# Altium schematic sheet uC_Environment.SchDoc
size A3; SheetNumber: 1; SheetTotal: 3; ENG_APP_DATE: --/--/--; DSN_APP_DATE: --/--/--; CHK_APP_DATE: --/--/--
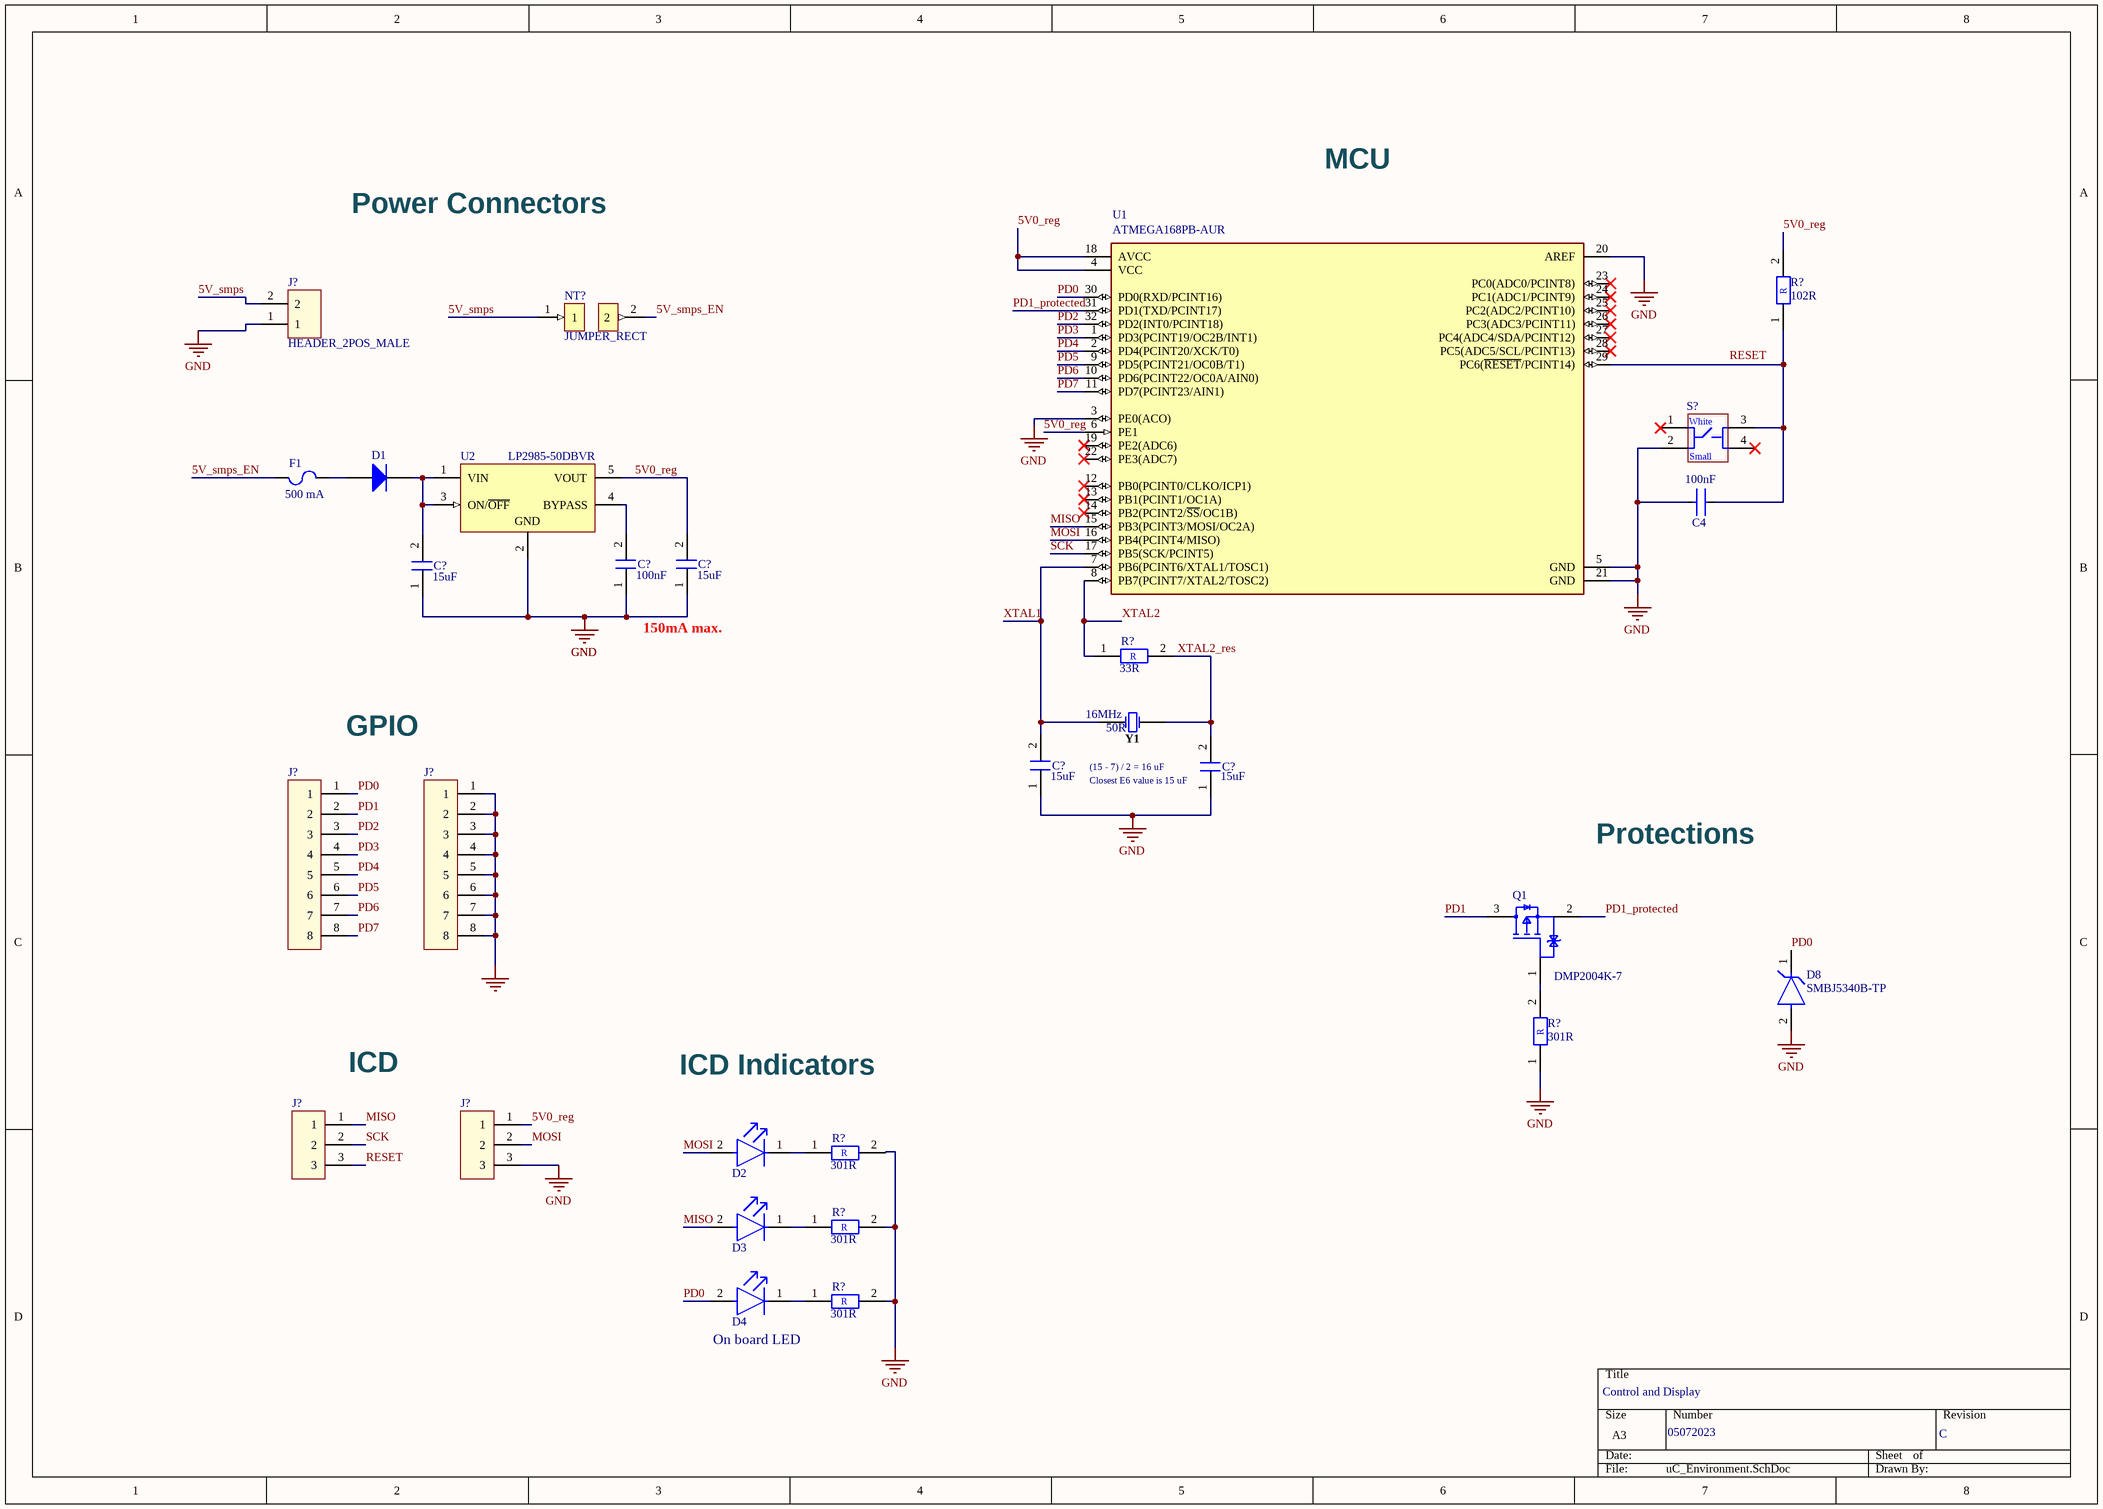
[diagram p0: uC_Environment.SchDoc]

## Parts
(Parts that share a designator on the sheet are numbered #1, #2 ... from top to bottom, then left to right.)
C4  Capacitance: 100nF  [FP-CL21-IPC_A]  (hidden comment: CL21B104KBCNNNC)
C?#1  Capacitance: 15uF  [0805_R]  (hidden comment: P.N.)
C?#2  Capacitance: 100nF  [0805_R]  (hidden comment: P.N.)
C?#3  Capacitance: 15uF  [0805_R]  (hidden comment: P.N.)
C?#4  Capacitance: 15uF  [0805_R]  (hidden comment: P.N.)
C?#5  Capacitance: 15uF  [0805_R]  (hidden comment: P.N.)
D1  SMAJ30A-E3/61  [VISH-DO-214AC-2_N]  (value not drawn)
D2  LTST-C191TBKT  [FP-LTST-C191TBKT-MFG]  (value not drawn)
D3  LTST-C191TBKT  [FP-LTST-C191TBKT-MFG]  (value not drawn)
D4  LTST-C191TBKT  [FP-LTST-C191TBKT-MFG]  (value not drawn)
D8  SMBJ5340B-TP  [FP-DO-214AA-MFG]
F1  Parameter 1: 500 mA  [0ZCJ0050AF2E-Footprint-1]  (hidden comment: 0ZCJ0050AF2E)
J?#1  HEADER_2POS_MALE  [HEADER_2POS_MALE_VERT_2.54MM]
J?#2  HEADER_8POS_MALE  [HEADER_8POS_MALE_VERT_2.54MM]  (value not drawn)
J?#3  HEADER_8POS_MALE  [HEADER_8POS_MALE_VERT_2.54MM]  (value not drawn)
J?#4  HEADER_3POS_MALE  [HEADER_3POS_MALE_VERT_2.54MM]  (value not drawn)
J?#5  HEADER_3POS_MALE  [HEADER_3POS_MALE_VERT_2.54MM]  (value not drawn)
NT?  JUMPER_RECT
Q1  DMP2004K-7  [FP-SOT23-MFG]
R?#1  Resistance: 102R  [0805_R]  (hidden comment: P.N.)
R?#2  Resistance: 33R  [0805_R]  (hidden comment: P.N.)
R?#3  Resistance: 301R  [0805_R]  (hidden comment: P.N.)
R?#4  Resistance: 301R  [0805_R]  (hidden comment: P.N.)
R?#5  Resistance: 301R  [0805_R]  (hidden comment: P.N.)
R?#6  Resistance: 301R  [0805_R]  (hidden comment: P.N.)
S?  TACT_SWITCH_SMD_5x3MM  [TACT_SWITCH_SMD_5x3MM]  (value not drawn)
U1  ATMEGA168PB-AUR  [FP-32A-MFG]
U2  LP2985-50DBVR  [DBV0005A_M]
Y1  Frequency: 16MHz  ESR (Equivalent Series Resistance): 50R  [ECS-160-20-3X-EN-TR-Footprint-1]  (hidden comment: ECS-160-20-3X-EN-TR)

## Nets
GND: C4.1 C?#1.1 C?#2.1 C?#3.1 C?#4.1 C?#5.1 D8.2(A) J?#1.1 J?#3.1 J?#3.2 J?#3.3 J?#3.4 J?#3.5 J?#3.6 J?#3.7 J?#3.8 J?#5.3 R?#3.1 R?#4.2 R?#5.2 R?#6.2 S?.2 U1.3(PE0(ACO)) U1.5(GND) U1.20(AREF) U1.21(GND) U2.2(GND)
5V0_reg: C?#3.2 J?#5.1 R?#1.2 U1.4(VCC) U1.6(PE1) U1.18(AVCC) U2.5(VOUT)
5V_smps: J?#1.2 NT?.1
5V_smps_EN: F1.1(IN) NT?.2
MISO: D3.2(A) J?#4.1 U1.15(PB3(PCINT3/MOSI/OC2A))
MOSI: D2.2(A) J?#5.2 U1.16(PB4(PCINT4/MISO))
PD0: D4.2(A) D8.1(C) J?#2.1 U1.30(PD0(RXD/PCINT16))
PD1: J?#2.2 Q1.3(D)
PD1_protected: Q1.2(S) U1.31(PD1(TXD/PCINT17))
PD2: J?#2.3 U1.32(PD2(INT0/PCINT18))
PD3: J?#2.4 U1.1(PD3(PCINT19/OC2B/INT1))
PD4: J?#2.5 U1.2(PD4(PCINT20/XCK/T0))
PD5: J?#2.6 U1.9(PD5(PCINT21/OC0B/T1))
PD6: J?#2.7 U1.10(PD6(PCINT22/OC0A/AIN0))
PD7: J?#2.8 U1.11(PD7(PCINT23/AIN1))
RESET: J?#4.3
SCK: J?#4.2 U1.17(PB5(SCK/PCINT5))
XTAL1: C?#4.2 U1.7(PB6(PCINT6/XTAL1/TOSC1)) Y1.2
XTAL2: R?#2.1 U1.8(PB7(PCINT7/XTAL2/TOSC2))
XTAL2_res: C?#5.2 R?#2.2 Y1.1
NetC4_2: C4.2 R?#1.1 S?.3 U1.29(PC6(~{RESET}/PCINT14))
NetC?#1_2: C?#1.2 D1.1(K) U2.1(VIN) U2.3(ON/~{OFF})
NetC?#2_2: C?#2.2 U2.4(BYPASS)
NetD1_2: D1.2(A) F1.2(OUT)
NetD2_1: D2.1(C) R?#4.1
NetD3_1: D3.1(C) R?#5.1
NetD4_1: D4.1(C) R?#6.1
NetQ1_1: Q1.1(G) R?#3.2

Not connected (* = marked no-connect by the designer): S? 1* 4*; U1 12(PB0(PCINT0/CLKO/ICP1))* 13(PB1(PCINT1/OC1A))* 14(PB2(PCINT2/~{SS}/OC1B))* 19(PE2(ADC6))* 22(PE3(ADC7))* 23(PC0(ADC0/PCINT8))* 24(PC1(ADC1/PCINT9))* 25(PC2(ADC2/PCINT10))* 26(PC3(ADC3/PCINT11))* 27(PC4(ADC4/SDA/PCINT12))* 28(PC5(ADC5/SCL/PCINT13))*

## Notes on the sheet
- MCU
- Power Connectors
- (near C?#3) 150mA max.
- GPIO
- (15 - 7) / 2 = 16 uF
- (near C?#5) Closest E6 value is 15 uF
- Protections
- (near J?#4) ICD
- ICD Indicators
- On board LED
- Control and Display
- 05072023
- C
- Labels drawn without touching a wire or pin: RESET
- DWG. NO.
- REV.
- SHT.
- THIS DOCUMENT AND THE DATA DISCLOSED HEREIN OR HEREWITH IS THE PROPERTY OF ALTIUM LIMITED AND MAY BE FREELY DISTRIBUTED IN WHOLE. NO RIGHTS ARE RESERVED OR EXPRESS OR IMPLIED WARANTEE GIVEN.
- REVISION
- DESCRIPTION
- DATE
- APPROVED
- ENG:
- APPROVALS
- PROJECT
- DSN:
- CHK:
- REFERENCE DOCUMENTS
- PROJECT REVISION:
- TITLE
- DOCUMENT REVISION:
- DESIGN ITEM:
- BOM:
- FAB DWG:
- PCB DWG:
- ASSY DWG:
- SCALE:
- SIZE
- B
- CAGE CODE
- FILE NAME
- DWG NO.
- SHEET
- OF
- REV
- (in symbol 0805_R) R
- (in symbol TACT_SWITCH_SMD_5x3MM) White; Small

## Library data of the parts
C4 = CMP-2000-05017-2: CL21 Series 0805 100nF 50V ±10% Tolerance X7R Multilayer Ceramic Chip Capacitor; Depth: 1.25mm; Height: 0.85mm; Width: 0.049inch; Tolerance: 10%; Case Code (Metric): 2012; Case Code (Imperial): 0805; Material: Ceramic; Thickness: 0.037inch; Min Operating Temperature: -55°C; Contact Plating: Tin; Length: 2mm; Mount: Surface Mount; Voltage Rating (DC): 50V; Lead Free: Lead Free; Dielectric: X7R; Radiation Hardening: No; Voltage Rating: 50V; Case/Package: 0805; Packaging: Tape and Reel; Max Operating Temperature: 125°C; Voltage: 50V
C?#1-C?#5 = 0805_C: Generic 0805 Capacitor; Voltage Rating: 10V; Dielectric: XR7
D1 = CMP-0548-00228-2: Transient Voltage Suppressor, 6.40 to 231 V, 30 V Stand-off Voltage, Uni-Directional, -55 to 155 degC, 2-pin DO-214AC, Pb-Free, Tape and Reel; Manufacturer: Vishay Semiconductor; ID (uA): 1; VWM (V): 30; IFSM: 40 A; PPPM (W): 400, 300; VBR Uni-Directional (V): 6.4 to 231; Mounting Technology: Surface Mount; Packing: Tape and Reel; ComponentLink1URL: http://www.vishay.com/; ComponentLink3URL: http://www.vishay.com/docs/88390/smaj50a.pdf; DatasheetVersion: 12/8/2013; RoHS: TRUE; PartNumber: SMAJ30A-E3/61; PackageReference: DO-214AC-2; ComponentLink2URL: http://www.vishay.com/docs/88390/smaj50a.pdf; ComponentLink1Description: Manufacturer URL; Operating Junction and Storage Temperature Range: -55 to 150 degC; PackageDescription: 2-Pin DO-214AC (SMA), Body 4.245 x 2.665 mm; ComponentLink3Description: Package Specification; ComponentLink2Description: Datasheet
D2-D4 = CMP-22017-000008-1: LED BLUE CLEAR CHIP SMD; Lens Color: Colorless; Dominant Wavelength: 475nm; Forward Current: 20mA; Wavelength: 468nm; Viewing Angle: 130°; Power Dissipation: 76mW; Luminous Intensity: 180mcd; Reverse Voltage: 5V; Number of Elements: 1; Lens Style: Diffused; Forward Voltage: 3.8V; Max Power Dissipation: 75mW; Case Code (Metric): 1608; Packaging: Tape and Reel; Case/Package: 0603; Depth: 1.6mm; Mount: Surface Mount; Lead Free: Lead Free; Min Operating Temperature: -20°C; Lens Transparency: Clear; Illumination Color: Blue; Height: 0.55mm; Test Current: 20mA; Case Code (Imperial): 0603; Max Operating Temperature: 80°C; Number of Pins: 2; Length: 0.8mm; Radiation Hardening: No; Package Quantity: 1; Number of LEDs: 1; Width: 0.8mm; Color: Blue
D8 = CMP-56208-000001-1: DIODE ZENER 6V 5W DO214AA; Manufacturer: Micro Commercial Components; Zener Impedance: 1Ω; Max Reverse Leakage Current: 1uA; Max Junction Temp: +150°C; Forward Current: 1A; Standoff Height: 0.05mm; Package: DO-214AA; Mouser Description: SMBJ Series 5 W 6 V 1 A Zener Diode-DO-214AA; Device Class L3: Zener Diodes; RoHS: TRUE; Power Dissipation: 5W; Nom Zener Voltage: 6V; Temperature Range High: +150°C; Lead Free: Yes; Category: Diode; Temperature: -55°C to +150°C; Height: 2.41mm; Automotive: No; Digikey Description: DIODE ZENER 6V 5W DO214AA; ComponentLink2Description: Datasheet; Octopart: https://octopart.com/smbj5340b-tp-mcc-19246153; ComponentLink2URL: https://www.mccsemi.com/pdf/Products/SMBJ5338B-SMBJ5388B%28SMB%29.pdf; Manufacturer Part Number: SMBJ5340B-TP; Temperature Range Low: -55°C; Device Class L1: Discrete Semiconductors; Device Class L2: Diodes
F1 = CMP-005-00013-2: PTC Resettable Fuse 0.5A(hold) 1A(trip) 24VDC 100A 0.6W 0.1s 0.15Ohm SMD Solder Pad 3.5 X 1.8 X 1.3mm T/R; Approvals: UL,TUV; Case Code (Metric): 3216; Case Code (Imperial): 1206; Case/Package: 1206
NT? = JUMPER_RECT: Small rectangular jumper
Q1 = CMP-12801-000029-1: MOSFET P-CH 20V 600MA SOT23-3; Manufacturer: Diodes Inc.; Max Junction Temp: +150°C; Turn On Delay Time: 8.5ns; Gate To Source Voltage: 8V; Input Capacitace At Vds: 175pF @ -16V; Rthja Max: 227°C/W; Drain To Source Resistance: 1.1Ω; Turn Off Delay Time: 20.2ns; Standoff Height: 0.013mm; Drain To Source Breakdown Voltage: -20V; Number Of P Channels: 1; Power Dissipation: 550mW; Pulse Drain Current: -1.9A; Depletion Mode: False; Max Forward Diode Voltage: -1.2V; Threshold Vgs Min: -0.5V; Threshold Vgs Max: -1V; Continuous Drain Current: -600mA; Manufacturer Part Number: DMP2004K-7; Height: 1.1mm; ComponentLink2Description: Datasheet; ComponentLink2URL: https://www.diodes.com/assets/Datasheets/ds30933.pdf; Package: SOT23; Footprint Url: https://www.diodes.com/assets/Package-Files/SOT23.pdf; Lead Free: Yes; Octopart: https://octopart.com/dmp2004k-7-diodes+inc.-7151877; Digikey Description: MOSFET P-CH 20V 600MA SOT23-3; Device Class L1: Discrete Semiconductors; Drain To Source Voltage: -20V; Mouser Description: MOSFET P-Channel; Number Of Channels: 1; Device Class L3: MOSFETs; Temperature: -55°C to +150°C; Category: Trans; Device Class L2: Transistors; Automotive: No; Temperature Range High: +150°C; RoHS: TRUE; Temperature Range Low: -55°C
R?#1-R?#6 = 0805_R: Generic 0805 Resistor; Power Rating: 0.5W
U1 = CMP-06276-000190-1: IC MCU 8BIT 16KB FLASH 32TQFP; RoHS Compliant: Yes
U2 = CMP-0758-00084-2: Single Output Low Noise LDO, 150 mA, Fixed 5 V Output, 1.5% Tolerance, 2.2 to 16 V Input, Low IQ, 5-Pin SOT-23 (DBV), -40 to 125 degC, Green (RoHS & no Sb/Br), Tape and Reel; Manufacturer: Texas Instruments; Accuracy (%): 1.5; Iout (Max) (A): 0.15; Fixed Output Options (V): 5; Vdo (Typ) (mV): 280; Output Options: Fixed Output; Iq (Typ) (mA): 0.85; DatasheetVersion: SLVS522N; PackageDescription: 5-Pin Plastic Small Outline, Body 2.9 x 1.6 mm, Pitch 0.95 mm; RoHS: TRUE; ComponentLink3URL: http://www.ti.com/litv/pdf/mpds018j; PartNumber: LP2985-50DBVR; PackageReference: DBV0005A; ComponentLink2URL: http://www.ti.com/lit/ds/symlink/lp2985-50.pdf; Mounting Technology: Surface Mount; ComponentLink1Description: Manufacturer URL; Vin (V): 2.2 to 16; ComponentLink3Description: Package Specification; ComponentLink1URL: http://www.ti.com/; PackageVersion: 4073253-4/L; ComponentLink2Description: Datasheet; Packing: Tape and Reel; Operating Temperature Range (degC): -40 to 125
Y1 = CMP-003-00030-1: Crystal 16MHz ±30ppm (Tol) ±50ppm (Stability) 20pF FUND 50Ohm 2-Pin HC-49/USX SMD T/R; Frequency Tolerance: 30ppm; Frequency Stability: 50ppm